# Altium project Switch_Board.PrjPCB
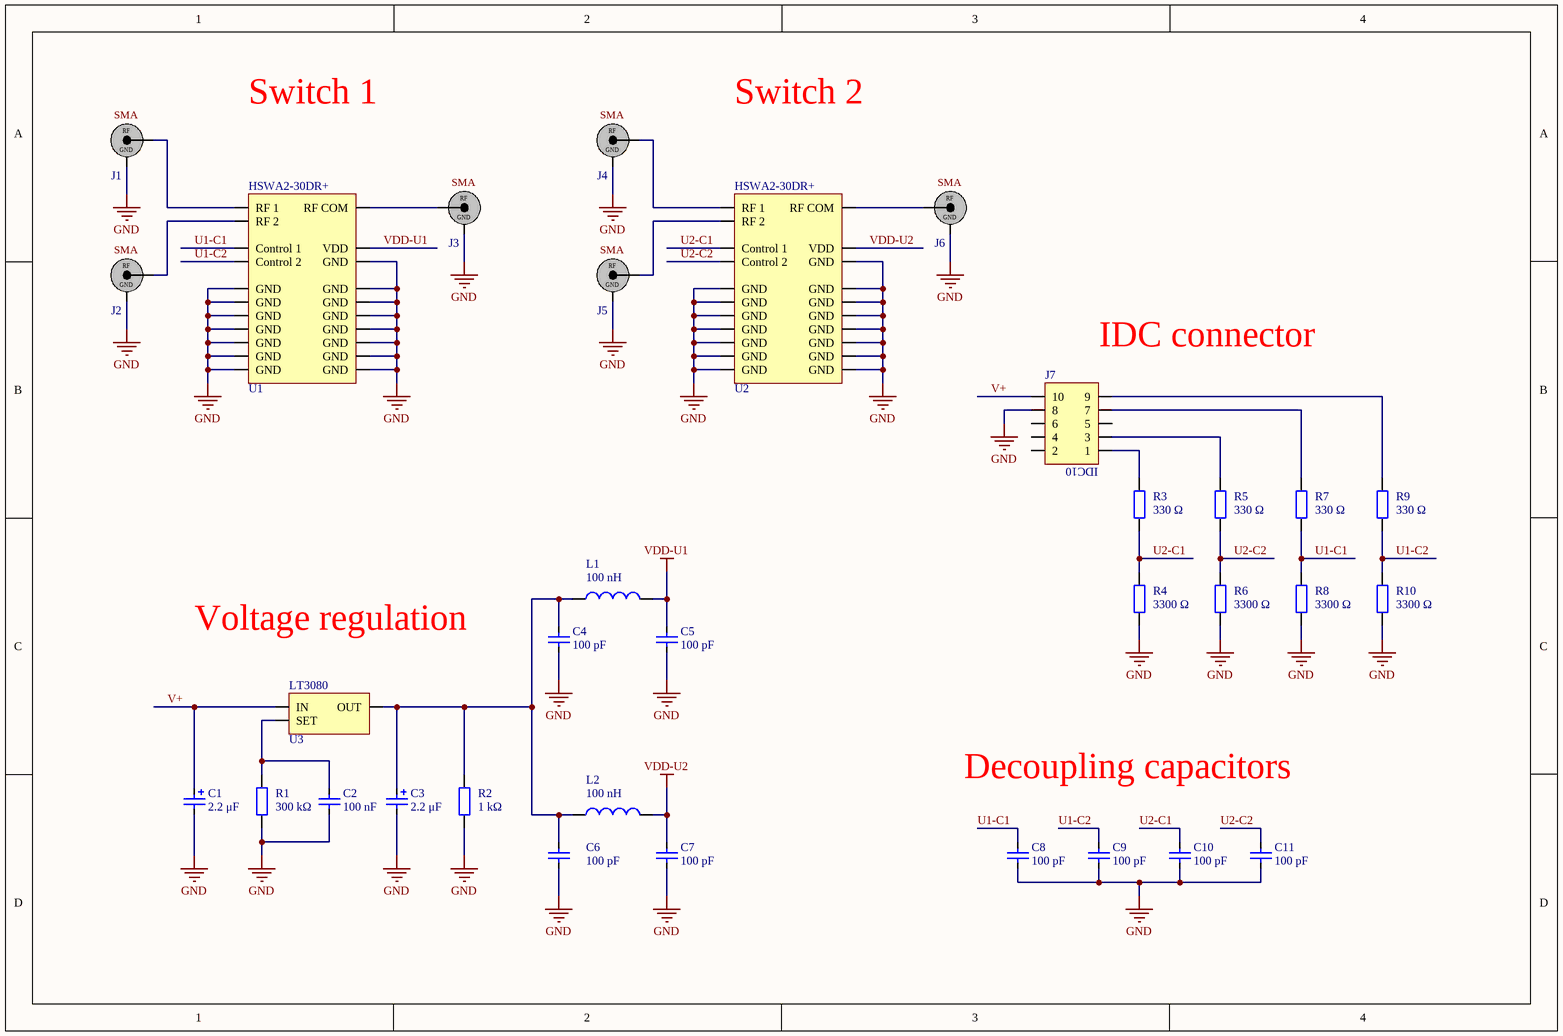
[diagram p0: Switch_Board.SchDoc]
1 sheet, 33 parts. Net scope: global (net labels, ports and power ports of the same name join across sheets).
Board file: Switch_Board.PcbDoc

## Sheet Switch_Board.SchDoc
size A4

### Parts
C1  value 2.2 μF  [EIA 3528-21]  (hidden comment: Capacitor (polarized))
C2  value 100 nF  [0603C]  (hidden comment: Capacitor)
C3  value 2.2 μF  [EIA 3528-21]  (hidden comment: Capacitor (polarized))
C4  value 100 pF  [0603C]  (hidden comment: Capacitor)
C5  value 100 pF  [0603C]  (hidden comment: Capacitor)
C6  value 100 pF  [0603C]  (hidden comment: Capacitor)
C7  value 100 pF  [0603C]  (hidden comment: Capacitor)
C8  value 100 pF  [0603C]  (hidden comment: Capacitor)
C9  value 100 pF  [0603C]  (hidden comment: Capacitor)
C10  value 100 pF  [0603C]  (hidden comment: Capacitor)
C11  value 100 pF  [0603C]  (hidden comment: Capacitor)
J1  SMA connector  [SMA edge connector]  (value not drawn)
J2  SMA connector  [SMA edge connector]  (value not drawn)
J3  SMA connector  [SMA edge connector]  (value not drawn)
J4  SMA connector  [SMA edge connector]  (value not drawn)
J5  SMA connector  [SMA edge connector]  (value not drawn)
J6  SMA connector  [SMA edge connector]  (value not drawn)
J7  IDC10  [IDC10]  (value not drawn)
L1  value 100 nH  [0603I]  (hidden comment: Inductor)
L2  value 100 nH  [0603I]  (hidden comment: Inductor)
R1  value 300 kΩ  [0805]  (hidden comment: Resistor)
R2  value 1 kΩ  [0805]  (hidden comment: Resistor)
R3  value 330 Ω  [0805]  (hidden comment: Resistor)
R4  value 3300 Ω  [0805]  (hidden comment: Resistor)
R5  value 330 Ω  [0805]  (hidden comment: Resistor)
R6  value 3300 Ω  [0805]  (hidden comment: Resistor)
R7  value 330 Ω  [0805]  (hidden comment: Resistor)
R8  value 3300 Ω  [0805]  (hidden comment: Resistor)
R9  value 330 Ω  [0805]  (hidden comment: Resistor)
R10  value 3300 Ω  [0805]  (hidden comment: Resistor)
U1  HSWA2-30DR+  [DG983-1]  (value not drawn)
U2  HSWA2-30DR+  [DG983-1]  (value not drawn)
U3  LT3080  [SOT-223]  (value not drawn)

### Nets
GND: C1.2 C2.1 C3.2 C4.1 C5.1 C6.1 C7.1 C8.1 C9.1 C10.1 C11.1 J1.0(GND) J2.0(GND) J3.0(GND) J4.0(GND) J5.0(GND) J6.0(GND) J7.8 R1.1 R2.1 R4.1 R6.1 R8.1 R10.1 U1.1(GND) U1.2(GND) U1.4(GND) U1.5(GND) U1.6(GND) U1.7(GND) U1.9(GND) U1.10(GND) U1.11(GND) U1.12(GND) U1.14(GND) U1.15(GND) U1.18(GND) U1.19(GND) U1.GND U2.1(GND) U2.2(GND) U2.4(GND) U2.5(GND) U2.6(GND) U2.7(GND) U2.9(GND) U2.10(GND) U2.11(GND) U2.12(GND) U2.14(GND) U2.15(GND) U2.18(GND) U2.19(GND) U2.GND
VDD-U1: C5.2 L1.2 U1.20(VDD)
VDD-U2: C7.2 L2.2 U2.20(VDD)
U1-C1: C8.2 R7.1 R8.2 U1.17(Control_1)
U1-C2: C9.2 R9.1 R10.2 U1.16(Control_2)
U2-C1: C10.2 R3.1 R4.2 U2.17(Control_1)
U2-C2: C11.2 R5.1 R6.2 U2.16(Control_2)
V+: C1.1 J7.10 U3.IN
NetC2_2: C2.2 R1.2 U3.SET
NetC3_1: C3.1 C4.2 C6.2 L1.1 L2.1 R2.2 U3.OUT
NetJ1_1: J1.1(RF) U1.3(RF_1)
NetJ2_1: J2.1(RF) U1.13(RF_2)
NetJ3_1: J3.1(RF) U1.8(RF_COM)
NetJ4_1: J4.1(RF) U2.3(RF_1)
NetJ5_1: J5.1(RF) U2.13(RF_2)
NetJ6_1: J6.1(RF) U2.8(RF_COM)
NetJ7_1: J7.1 R3.2
NetJ7_3: J7.3 R5.2
NetJ7_7: J7.7 R7.2
NetJ7_9: J7.9 R9.2

Not connected (* = marked no-connect by the designer): J7 2 4 5 6

### Notes on the sheet
- Switch 1
- Switch 2
- (near J7) IDC connector
- (near C4) Voltage regulation
- Decoupling capacitors
- (in symbol SMA connector) SMA

### Library data of the parts
C1 C3 = Capacitor (polarized): General symbol for a surface-mount polarized capacitor
C2 C4-C11 = Capacitor: General symbol for a surface-mount capacitor
J1-J6 = SMA connector: SMA PCB jack; pin to pad: 0>GND 1>RF
J7 = IDC10: IDC connector, 10 pin, right angle
L1 L2 = Inductor: General symbol for a surface-mount inductor
R1-R10 = Resistor: General symbol for a surface-mount resistor
U1 U2 = HSWA2-30DR+: Mini-Circuits surface-mount RF switch
U3 = LT3080: Linear Technology surface-mount adjustable voltage regulator; ComponentLink1URL: http://cds.linear.com/docs/en/datasheet/3080fc.pdf; ComponentLink1Description: Datasheet for LT3080